# Altium schematic sheet 05_Human_Interaction.SchDoc: Test
size A4; DrawnBy: Estiaan Botha; SheetNumber: 7; SheetTotal: 9
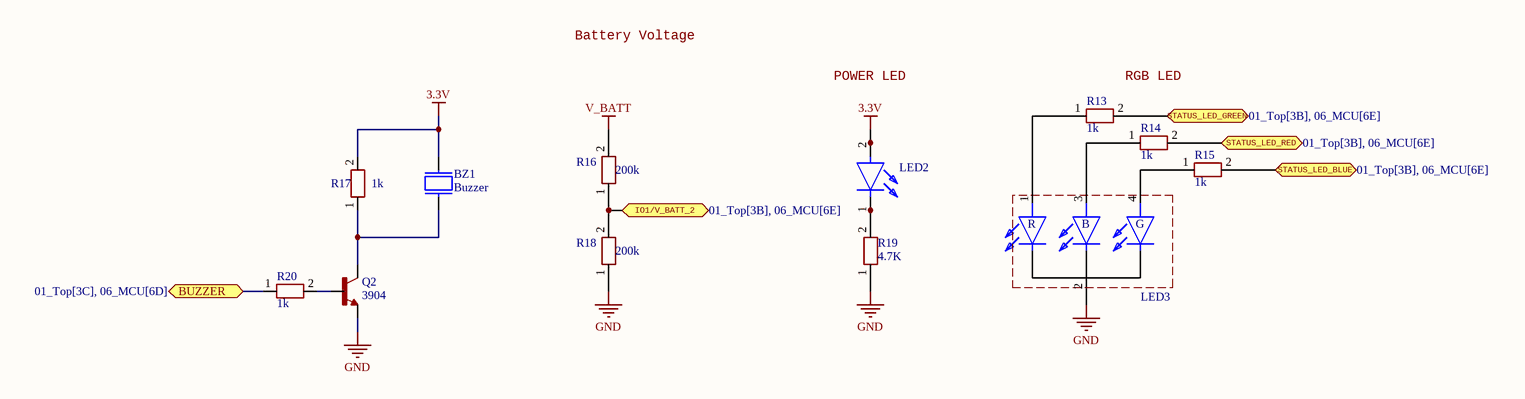
[diagram p0: 05_Human_Interaction.SchDoc]

## Parts
BZ1  Buzzer  [3XDCR_PS1240P02CT3]
LED2  LED YELLOW 0805 SMD  [LYM676Q2S126Z]  (value not drawn)
LED3  LED RGB THP SRAIGHT-LEG  [LED THP Dialight 521-8559F]  (value not drawn)
Q2  3904  [SOT95P230X110-3N]
R13  1k  [RESC2012X60N]
R14  1k  [RESC2012X60N]
R15  1k  [RESC2012X60N]
R16  200k  [RESC2012X60N]
R17  1k  [RESC2012X60N]
R18  200k  [RESC2012X60N]
R19  4.7K  [RESC2012X50N]
R20  1k  [RESC2012X60N]

## Ports
BUZZER (bidir, see 01_Top[3C], 06_MCU[6D]), IO1/V_BATT_2 (bidir, see 01_Top[3B], 06_MCU[6E]), STATUS_LED_BLUE (bidir, see 01_Top[3B], 06_MCU[6E]), STATUS_LED_GREEN (bidir, see 01_Top[3B], 06_MCU[6E]), STATUS_LED_RED (bidir, see 01_Top[3B], 06_MCU[6E])

## Nets
3.3V: BZ1.2 LED2.2(A) R17.2
GND: LED3.2 Q2.E R18.1 R19.1
V_BATT: R16.2
BUZZER: R20.1 ; port BUZZER
IO1/V_BATT_2: R16.1 R18.2 ; port IO1/V_BATT_2
STATUS_LED_BLUE: R15.2 ; port STATUS_LED_BLUE
STATUS_LED_GREEN: R13.2 ; port STATUS_LED_GREEN
STATUS_LED_RED: R14.2 ; port STATUS_LED_RED
NetBZ1_1: BZ1.1 Q2.C R17.1
NetLED2_1: LED2.1(K) R19.2
NetLED3_1: LED3.1(K) R13.1
NetLED3_3: LED3.3(K) R14.1
NetLED3_4: LED3.4(K) R15.1
NetQ2_B: Q2.B R20.2

## Notes on the sheet
- Battery Voltage
- POWER LED
- (near R13) RGB LED
- (in symbol LED RGB THP SRAIGHT-LEG) R; B; G

## Library data of the parts
BZ1 = INDICATOR BUZZER PIEZO PS1240P02CT3: Buzzers Transducer, Externally Driven Piezo 3V 4kHz 60dB @ 3V, 10cm Through Hole PC Pins; Manufacturer_Part_Number: PS1240P02CT3; ComponentLink1Description: Datasheet; ComponentLink1URL: https://product.tdk.com/system/files/dam/doc/product/sw_piezo/sw_piezo/piezo-buzzer/catalog/piezoelectronic_buzzer_ps_en.pdf
LED2 = LED YELLOW 0805 SMD: Single Colour LED Yellow 20mA; Manufacturer_Part_Number: LY M676-Q2S1-26-Z; ComponentLink1Description: Datasheet; ComponentLink1URL: https://www.mouser.com/datasheet/2/588/Osram_7222021_LY__M676_EN-2891431.pdf
LED3 = LED RGB THP SRAIGHT-LEG: RGB LED Dialight 521-8559F; Manufacturer_Part_Number: 521-8559F; ComponentLink1Description: Datasheet; ComponentLink1URL: https://www.mouser.co.za/datasheet/2/109/C18455B-1843429.pdf
Q2 = BJT NPN 3904 SMD SOT-23: NPN SMALL SIGNAL SURFACE MOUNT TRANSISTOR; Manufacturer_Part_Number: MMBT3904
R13-R15 R17 R20 = RES 1K 0805 SMD: Resistor; Manufacturer_Part_Number: RC0805JR-071KL
R16 R18 = RES 200K 0805 SMD: Resistor; Manufacturer_Part_Number: SG73P2ATTD2003F
R19 = RES 4.7K 0805 SMD: Resistor; Manufacturer_Part_Number: CRCW08054K70FKEA